# Altium schematic sheet CONNECTORS.SchDoc
size A4; Organization: Electronic Research & Design; Address1: 11 Granofier; Address2: Zwartkop; Address3: Centurion; Address4: South Africa; Revision: 0
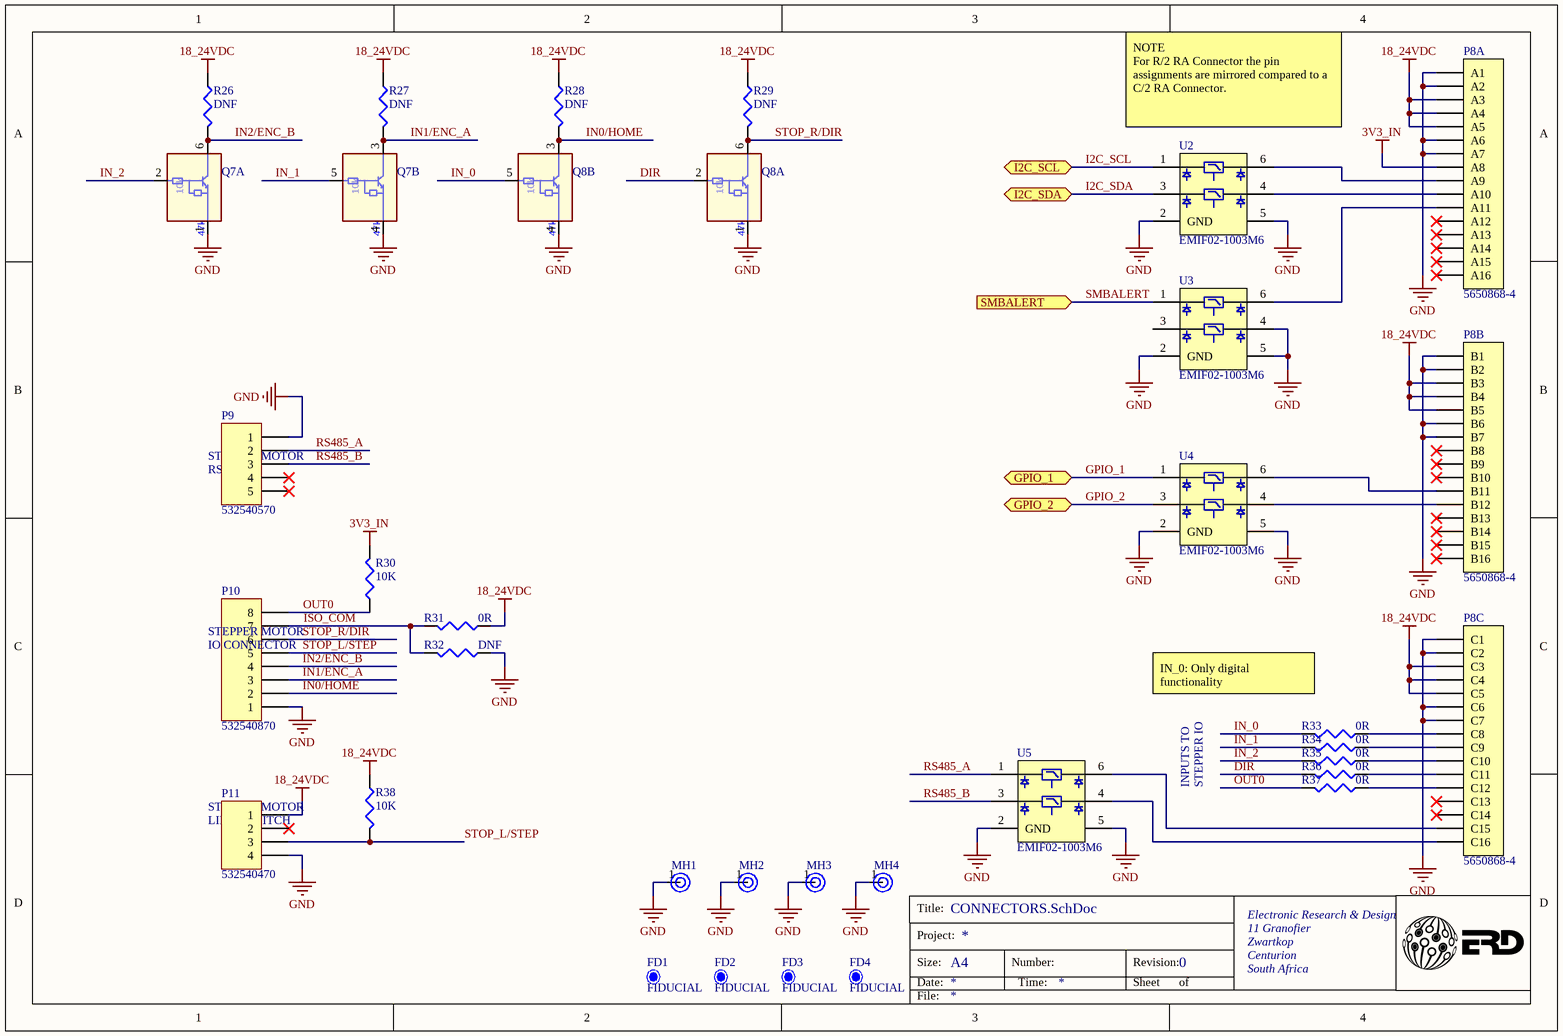
[diagram p0: CONNECTORS.SchDoc]

## Parts
FD1  FIDUCIAL  [FIDUCIAL]
FD2  FIDUCIAL  [FIDUCIAL]
FD3  FIDUCIAL  [FIDUCIAL]
FD4  FIDUCIAL  [FIDUCIAL]
MH1  MH  [MH - M3]  (value not drawn)
MH2  MH  [MH - M3]  (value not drawn)
MH3  MH  [MH - M3]  (value not drawn)
MH4  MH  [MH - M3]  (value not drawn)
P8  5650868-4  [5650868-4_F_RA]  (parts A,B,C of 3)
P9  532540570  [HDR1X5]
P10  532540870  [HDR1X8]
P11  532540470  [HDR1X4]
Q7  DDC114YU-7-F  [SMini6-F3-B]  (value not drawn)  (parts A,B of 2)
Q8  DDC114YU-7-F  [SMini6-F3-B]  (value not drawn)  (parts A,B of 2)
R26  DNF  [RC0402]
R27  DNF  [RC0402]
R28  DNF  [RC0402]
R29  DNF  [RC0402]
R30  10K  [RC0402]
R31  0R  [RC0402]
R32  DNF  [RC0402]
R33  0R  [RC0402]
R34  0R  [RC0402]
R35  0R  [RC0402]
R36  0R  [RC0402]
R37  0R  [RC0402]
R38  10K  [RC0402]
U2  EMIF02-1003M6  [uQFN-6L]
U3  EMIF02-1003M6  [uQFN-6L]
U4  EMIF02-1003M6  [uQFN-6L]
U5  EMIF02-1003M6  [uQFN-6L]

## Ports
GPIO_1 (bidir), GPIO_2 (bidir), I2C_SCL (bidir), I2C_SDA (bidir), SMBALERT (in)

## Nets
3V3_IN: P8.8(A8) R30.2
18_24VDC: P8.3(A3) P8.4(A4) P8.5(A5) P8.19(B3) P8.20(B4) P8.21(B5) P8.35(C3) P8.36(C4) P8.37(C5) P11.1 R26.2 R27.2 R28.2 R29.2 R31.2 R38.2
GND: MH1.1 MH2.1 MH3.1 MH4.1 P8.1(A1) P8.2(A2) P8.6(A6) P8.7(A7) P8.17(B1) P8.18(B2) P8.22(B6) P8.23(B7) P8.33(C1) P8.34(C2) P8.38(C6) P8.39(C7) P9.1 P10.1 P11.4 Q7.1 Q7.4 Q8.1 Q8.4 R32.2 U2.2(GND) U2.5(GND) U3.2(GND) U3.4 U3.5(GND) U4.2(GND) U4.5(GND) U5.2(GND) U5.5(GND)
DIR: Q8.2 R36.2
GPIO_1: U4.1 ; port GPIO_1
GPIO_2: U4.3 ; port GPIO_2
I2C_SCL: U2.1 ; port I2C_SCL
I2C_SDA: U2.3 ; port I2C_SDA
IN0/HOME: P10.2 Q8.3 R28.1
IN1/ENC_A: P10.3 Q7.3 R27.1
IN2/ENC_B: P10.4 Q7.6 R26.1
IN_0: Q8.5 R33.2
IN_1: Q7.5 R34.2
IN_2: Q7.2 R35.2
ISO_COM: P10.7 R31.1 R32.1
OUT0: P10.8 R30.1 R37.2
RS485_A: P9.2 U5.1
RS485_B: P9.3 U5.3
SMBALERT: U3.1 ; port SMBALERT
STOP_L/STEP: P10.5 P11.3 R38.1
STOP_R/DIR: P10.6 Q8.6 R29.1
NetP8_9: P8.9(A9) U2.6
NetP8_10: P8.10(A10) U2.4
NetP8_11: P8.11(A11) U3.6
NetP8_27: P8.27(B11) U4.6
NetP8_28: P8.28(B12) U4.4
NetP8_40: P8.40(C8) R33.1
NetP8_41: P8.41(C9) R34.1
NetP8_42: P8.42(C10) R35.1
NetP8_43: P8.43(C11) R36.1
NetP8_44: P8.44(C12) R37.1
NetP8_47: P8.47(C15) U5.6
NetP8_48: P8.48(C16) U5.4

Not connected (* = marked no-connect by the designer): P8 12(A12)* 13(A13)* 14(A14)* 15(A15)* 16(A16)* 24(B8)* 25(B9)* 26(B10)* 29(B13)* 30(B14)* 31(B15)* 32(B16)* 45(C13)* 46(C14)*; P9 4* 5*; P11 2*; U3 3

## Notes on the sheet
- (near U2) NOTE
  For R/2 RA Connector the pin assignments are mirrored compared to a C/2 RA Connector.
- RS485
- STEPPER MOTOR
- IO CONNECTOR
- IN_0: Only digital functionality
- INPUTS TO
- STEPPER IO
- LIMIT SWITCH
- Title:
- Size:
- Date:
- Project:
- A4
- Number:
- Time:
- Revision:
- Sheet
- of
- File:
- (in symbol RN1907, part A) 10k; 47k
- (in symbol RN1907, part B) 10k; 47k

## Library data of the parts
FD1-FD4 = FIDUCIAL: Fiducial 2mm; PartNumber: NA
MH1-MH4 = MountingHole: Mounting Hole; PartNumber: NA
P8 = DIN_41612_3x16: DIN-41612, R/2, 48-circuit, 3x16, 2.54mm pitch, RA, TH; Manufacturer: TE Connectivity; PartNumber: 5650868-4
P9 = Header 5: Header, RA, 5-circuit, 2mm pitch, TH; Manufacturer: Molex; PartNumber: 532540570
P10 = Header 8: Header, RA, 8-circuit, 2mm pitch, TH; Manufacturer: Molex; Mating Part: 0510650800; PartNumber: 532540870
P11 = Header 4: Header, RA, 4-circuit, 2mm pitch, TH; Manufacturer: Molex; PartNumber: 532540470
Q7 Q8 = RN1907: TRANS PREBIASED DUAL NPN SOT363; Manufacturer: Diodes Inc; Manufacturer Part Number: DDC114YU-7-F; Package / Case: 6-TSSOP, SC-88, SOT-363; Supplier: AAD; Supplier Stock Code: N/A
R26-R30 R38 = RES_10K_1/16W_1%_0402: RES, 10K OHM, 1/16W, 1%, 0402; Manufacturer: Yageo; Part Number: RC0402FR-0710KL; Package / Case: 0402 (1005 Metric); Supplier: AAD
R31-R37 = RES_10K_1/16W_1%_0402: RES, 0 OHM, 1/16W, 1%, 0402; Manufacturer: Yageo; PartNumber: RC0402FR-070RL; Package / Case: 0402 (1005 Metric); Supplier: AAD
U2-U5 = EMIF02-1003M6: EMI Filter, ESD, uQFN-6; PartNumber: EMIF02-1003M6